# EAGLE design 9_1wire (EAGLE 7.6.0)
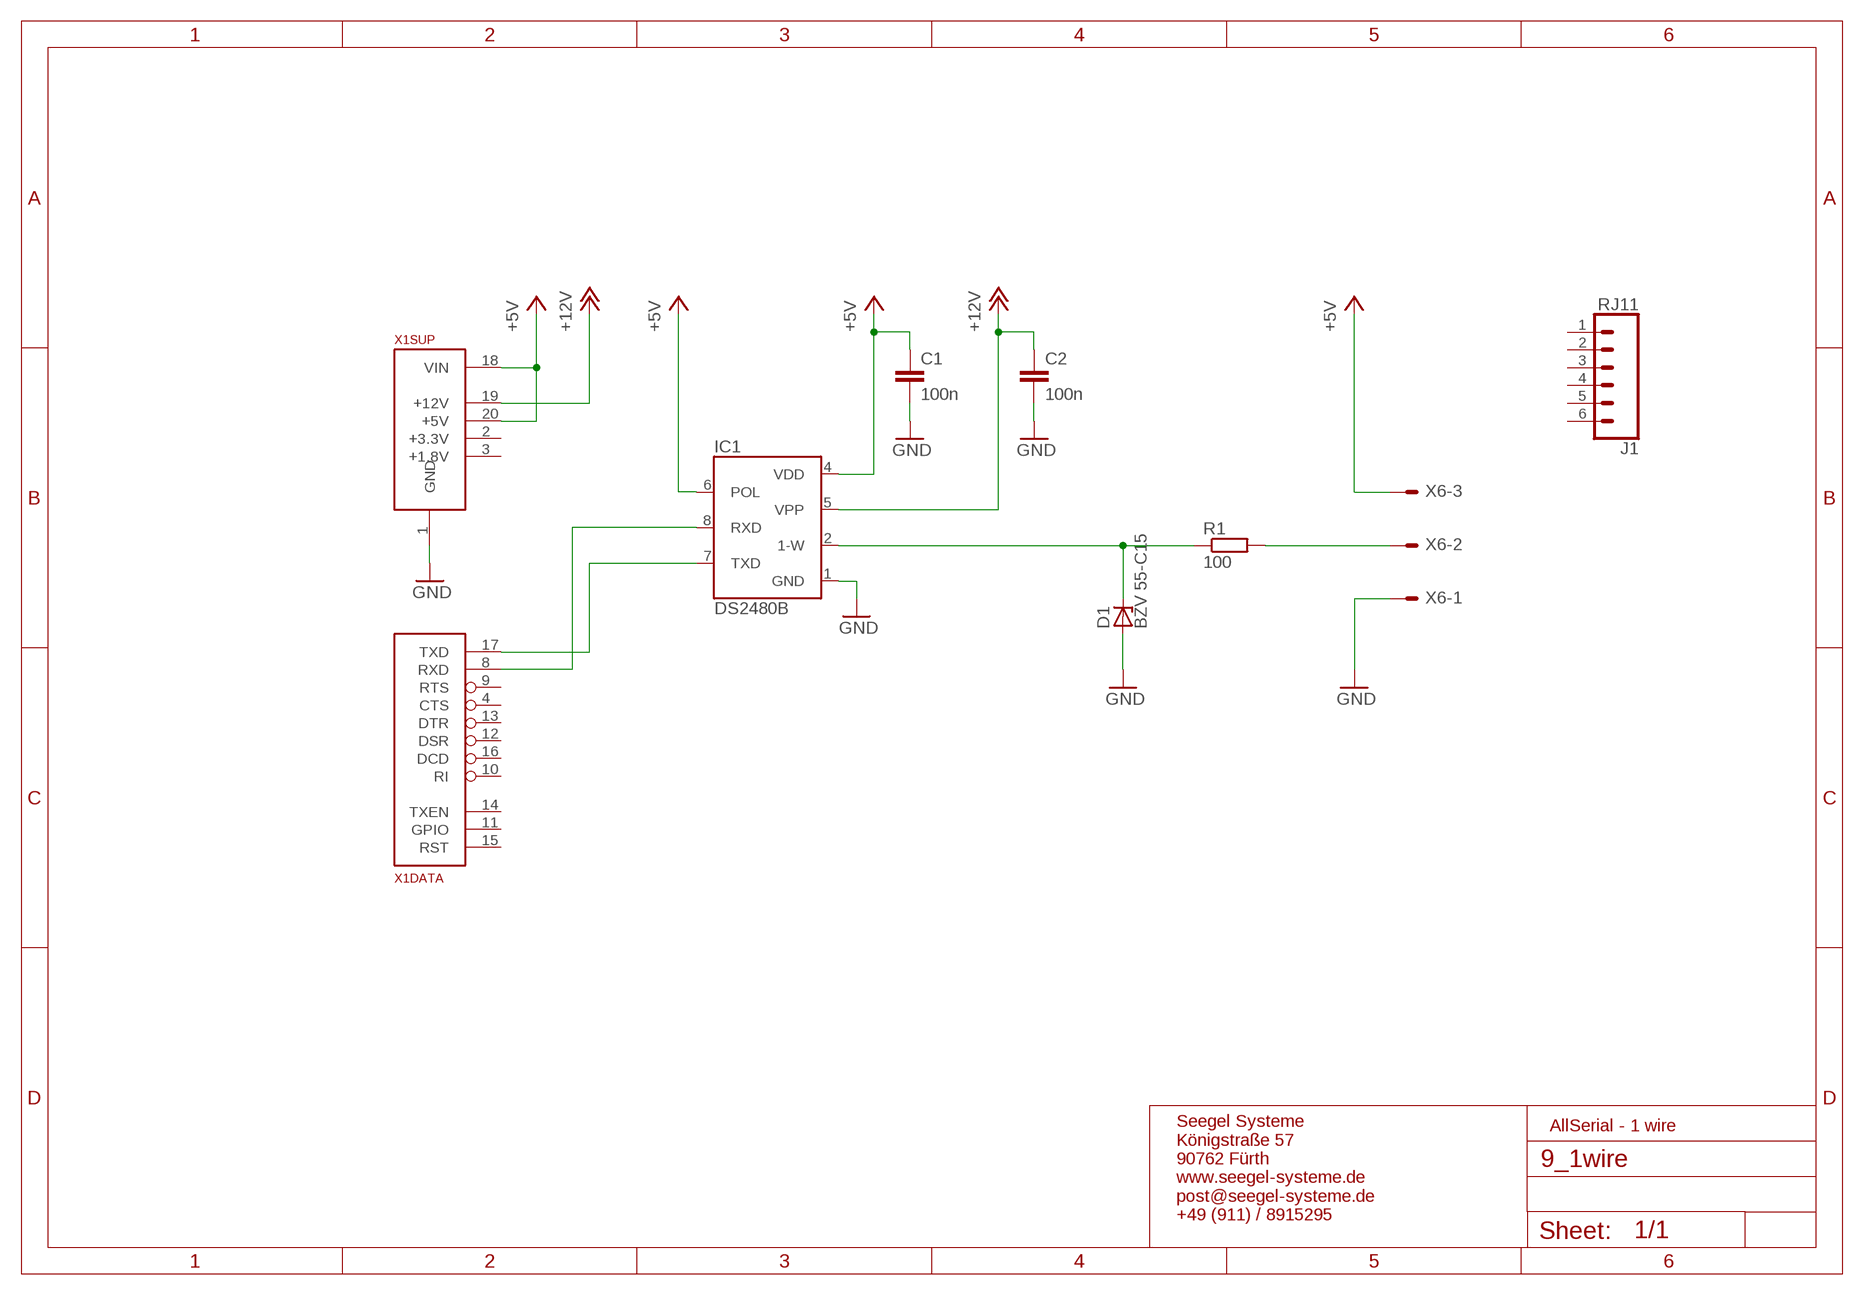
[diagram p0: schematic, sheet 1]

## Parts
C1  100n  C-EUC0805  [C0805]
C2  100n  C-EUC0805  [C0805]
D1  BZV 55-C15  ZENER-DIODESOD80C  [SOD80C]
IC1  DS2480B  [SO08]
J1  RJ11  RJ11-6  [RJ11-6]
R1  100  R-EU_R0805  [R0805]
X1  ALLSERIALSLAVE  [DAUGHTER-THT]
X6  AKL18X-03W  [AKL182-03]

## Nets
+5V: C1.1 IC1.4(VDD) IC1.6(POL) X1.18(SUP:VIN) X1.20(SUP:+5V) X6.P$3
+12V: C2.1 IC1.5(VPP) X1.19(SUP:+12V)
GND: C1.2 C2.2 D1.A IC1.1(GND) X1.1(SUP:GND) X6.P$1
N$1: IC1.7(TXD) X1.17(DATA:TXD)
N$2: IC1.8(RXD) X1.8(DATA:RXD)
N$3: D1.C IC1.2(1-W) R1.1
N$4: R1.2 X6.P$2
Unconnected: J1.1 J1.2 J1.3 J1.4 J1.5 J1.6 X1.2(SUP:+3.3V) X1.3(SUP:+1.8V) X1.4(DATA:CTS) X1.5(USB:D-) X1.6(USB:D+) X1.7(USB:VUSB) X1.9(DATA:RTS) X1.10(DATA:RI) X1.11(DATA:GPIO) X1.12(DATA:DSR) X1.13(DATA:DTR) X1.14(DATA:TXEN) X1.15(DATA:RST) X1.16(DATA:DCD)

## Notes on the sheet
- AllSerial - 1 wire
- Seegel Systeme
  Königstraße 57
  90762 Fürth
  www.seegel-systeme.de
  post@seegel-systeme.de
  +49 (911) / 8915295

## Library data of the parts
C1 C2 = rcl:C-EU: CAPACITOR, European symbol
D1 = diode:ZENER-DIODE: Z-Diode
IC1 = Asa's IC:DS2480B: DS2480B, Serial to 1-Wire Line Driver, Maxim, SO-08; REICHELT: DS 2480 B
J1 = SparkFun-Connectors:RJ11-6: RJ11 Jack - 6 pin Commonly found on CAT3 devices and some Microchip programmers. Here is the connector we sell at SparkFun: RJ11 6-Pin Connector <https://www.sparkfun.com/products/132> (PRT-00132) Datasheet <http://www.sparkfun.com/datasheets/Prototyping/Connectors/RJ11-Datasheet.pdf> It is used on this SparkFun product: SparkFun Weather Shield <https://www.sparkfun.com/products/12081> (DEV-12081) Weather Meters <https://www.sparkfun.com/products/8942> (SEN-08942); PROD_ID: CONN-08590; SF_ID: PRT-00132
R1 = rcl:R-EU_: RESISTOR, European symbol
X1 = AllSerialv2:ALLSERIALSLAVE
X6 = con-riacon_akl:AKL18X-03: Riacon AKL18X Steckverbinder 3-Pol Grid = 3,5mm

## Board
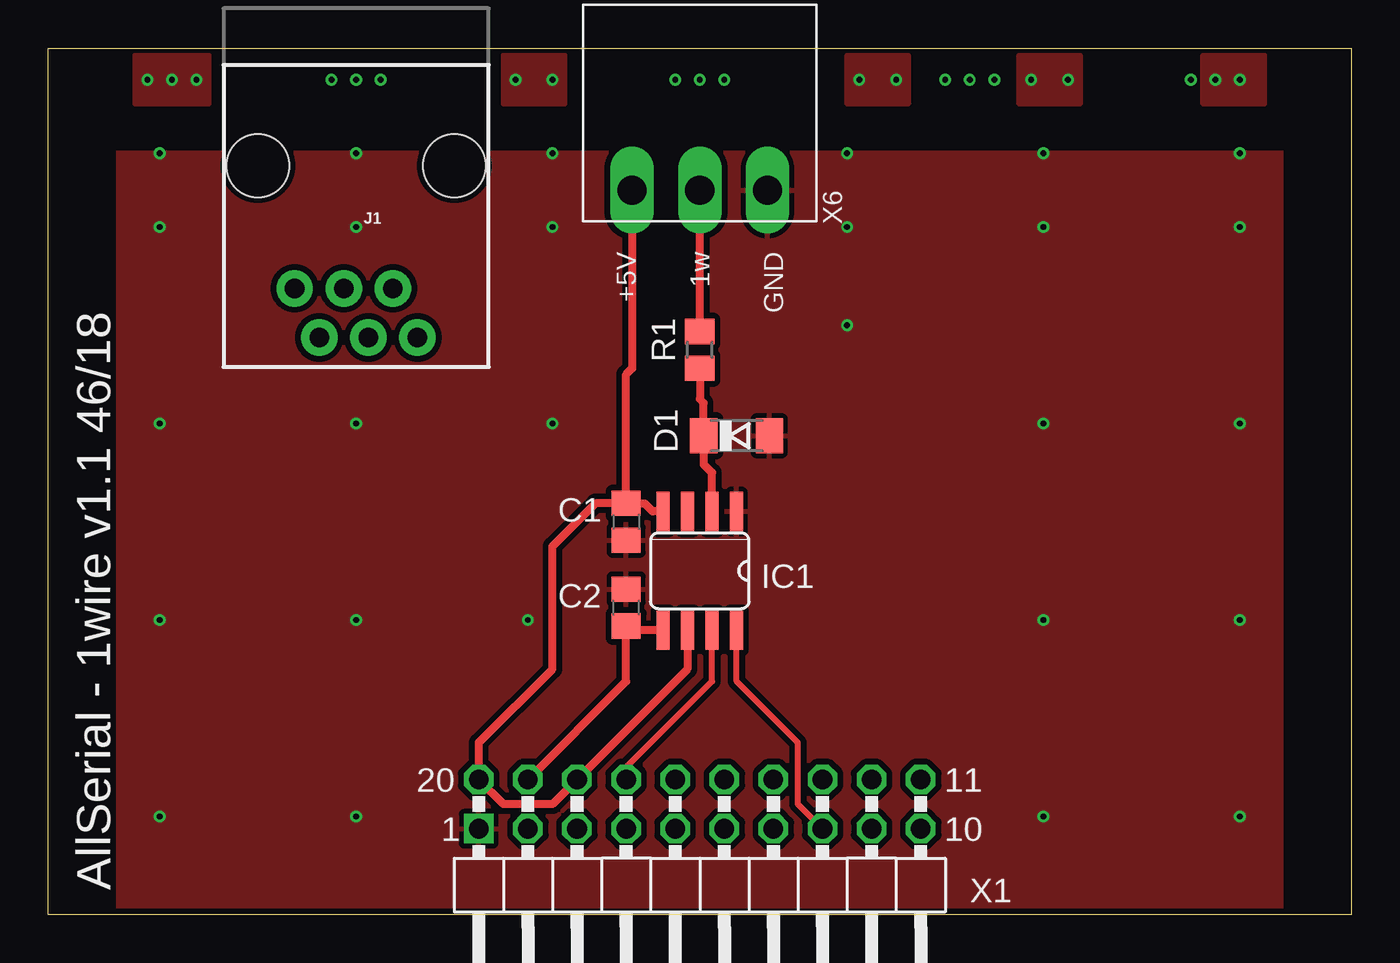
[diagram p1: board, top side]
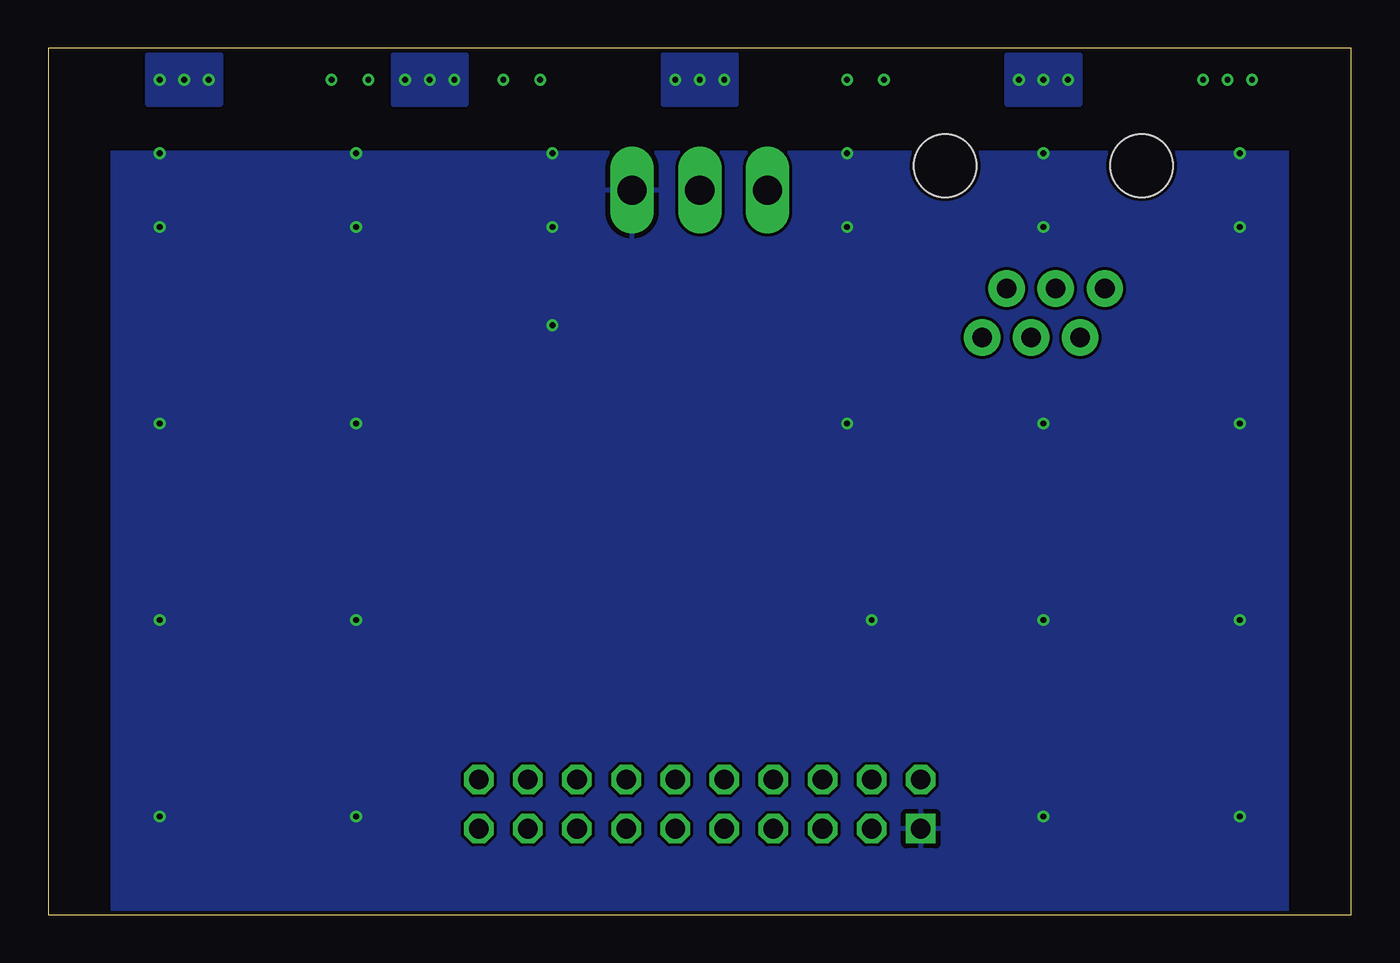
[diagram p2: board, bottom side, seen from below]

Size 67.4 x 44.8 mm. Coordinates in mm from the lower left corner, seen from the top.
Copper layers (1*16): Top 0.035mm / dielectric 1.6mm / Bottom 0.035mm
Design rules "Elecrow_2-layer_PCB_eagle_rule *": minimum track width 6mil, minimum drill 0.3mm, track to track 6mil, track to pad 6mil, pad to pad 6mil, via to via 8mil, smd to smd 0mil, copper to edge 0.2mm, drill to drill 10mil, minimum pad ring 6mil, minimum via ring 6mil, stop-mask expansion 0mil, vias tented up to drill 0.3mm, thermal gap 10mil

### Footprints (pad centres in the part's own frame; a part is rotated, then mirrored left to right if it is on the bottom)
C0805 = smd 1.3 x 1.5: 1 -0.95,0; 2 0.95,0
SOD80C = smd 1.4 x 1.8: A 1.7,0; C -1.7,0
SO08 = smd 0.66 x 2.032: 1 -1.905,-3.073; 2 -0.635,-3.073; 3 0.635,-3.073; 4 1.905,-3.073; 5 1.905,3.073; 6 0.635,3.073; 7 -0.635,3.073; 8 -1.905,3.073
RJ11-6 = drill 1.016 pad 1.88: 1 -3.175,8.89; 2 -1.905,6.35; 3 -0.635,8.89; 4 0.635,6.35; 5 1.905,8.89; 6 3.175,6.35 | hole 3.251: -5.08,0; 5.08,0
R0805 = smd 1.3 x 1.5: 1 -0.95,0; 2 0.95,0
DAUGHTER-THT = drill 1.016 square: 1 -11.43,4.445 | drill 1.016 octagon: 2 -8.89,4.445; 3 -6.35,4.445; 4 -3.81,4.445; 5 -1.27,4.445; 6 1.27,4.445; 7 3.81,4.445; 8 6.35,4.445; 9 8.89,4.445; 10 11.43,4.445; 11 11.43,6.985; 12 8.89,6.985; 13 6.35,6.985; 14 3.81,6.985; 15 1.27,6.985; 16 -1.27,6.985; 17 -3.81,6.985; 18 -6.35,6.985; 19 -8.89,6.985; 20 -11.43,6.985
AKL182-03 = drill 1.5 pad 2.184 long: P$1 -3.5,0; P$2 0,0; P$3 3.5,0

### Placement (x,y rotation side)
C1  29.89,20.32 270 top
C2  29.89,15.88 90 top
D1  35.61,24.77 0 top
IC1  33.7,17.78 180 top
J1  15.92,38.73 180 top
R1  33.7,29.21 90 top
X1  33.7,0 0 top
X6  33.7,37.47 180 top

### Tracks (layer width: path | path; a pad name or v marks a point on that pad's centre or on a via)
+5V
  Top 0.406: IC1.4 31.26,20.85 30.85,21.27 C1.1 | C1.1 28.3,21.27 26.08,19.05 26.08,12.7 22.27,8.89 X1.20 23.54,5.71 26.08,5.71 X1.18 33.07,12.7 IC1.6 | C1.1 29.89,27.94 30.2,28.25 X6.P$3
+12V
  Top 0.406: X1.19 29.89,12.06 C2.1 30.11,14.71 IC1.5
GND  (via drill 0.3)
  other vias: 26.08,39.37 15.92,39.37 5.76,39.37 5.76,35.56 15.92,35.56 26.08,35.56 5.76,25.4 15.92,25.4 15.92,15.24 5.76,15.24 5.76,5.08 15.92,5.08 26.08,25.4 24.81,15.24 41.32,30.48 41.32,35.56 41.32,39.37 51.48,39.37 51.48,35.56 61.64,39.37 61.64,35.56 51.48,25.4 61.64,25.4 61.64,15.24 51.48,15.24 51.48,5.08 61.64,5.08
  pour Bottom: -0.59,39.37 67.99,39.37 67.99,0 -0.59,0
  pour Top (isolate 0.305): -0.59,0 67.99,0 67.99,39.37 -0.59,39.37
N$1
  Top 0.305: X1.17 29.89,7.62 34.34,12.06 IC1.7
N$2
  Top 0.305: X1.8 38.78,5.71 38.78,8.89 35.61,12.06 IC1.8
N$3
  Top 0.406: IC1.2 34.34,22.86 33.91,23.29 D1.C 33.91,26.46 33.7,26.67 R1.1
N$4
  Top 0.406: R1.2 X6.P$2
N$5  (via drill 0.3)
  other vias: 5.13,43.18 6.4,43.18 7.67,43.18
  pour Top: 4.49,44.45 8.3,44.45 8.3,41.91 4.49,41.91
N$6  (via drill 0.3)
  other vias: 15.92,43.18 14.65,43.18 17.19,43.18
  pour Bottom: 14.02,44.45 17.83,44.45 17.83,41.91 14.02,41.91
N$7  (via drill 0.3)
  other vias: 33.7,43.18 32.43,43.18 34.97,43.18
  pour Bottom: 31.8,44.45 35.61,44.45 35.61,41.91 31.8,41.91
N$9  (via drill 0.3)
  other vias: 47.67,43.18 46.4,43.18 48.94,43.18
  pour Bottom: 45.77,44.45 49.58,44.45 49.58,41.91 45.77,41.91
N$51  (via drill 0.3)
  other vias: 24.18,43.18 26.08,43.18
  pour Top: 23.54,44.45 26.72,44.45 26.72,41.91 23.54,41.91
N$52  (via drill 0.3)
  other vias: 41.96,43.18 43.86,43.18
  pour Top: 41.32,44.45 44.5,44.45 44.5,41.91 41.32,41.91
N$53  (via drill 0.3)
  other vias: 50.85,43.18 52.75,43.18
  pour Top: 50.21,44.45 53.39,44.45 53.39,41.91 50.21,41.91
N$54  (via drill 0.3)
  other vias: 59.1,43.18 60.37,43.18 61.64,43.18
  pour Top: 59.74,44.45 62.91,44.45 62.91,41.91 59.74,41.91
  pour Bottom: 58.47,44.45 62.28,44.45 62.28,41.91 58.47,41.91

### Text on the board
tPlace: +5V | 1w | GND | AllSerial - 1wire v1.1 46/18